# EAGLE design AVR-BASE (EAGLE 7.2.0)

## Sheet 1 of 2
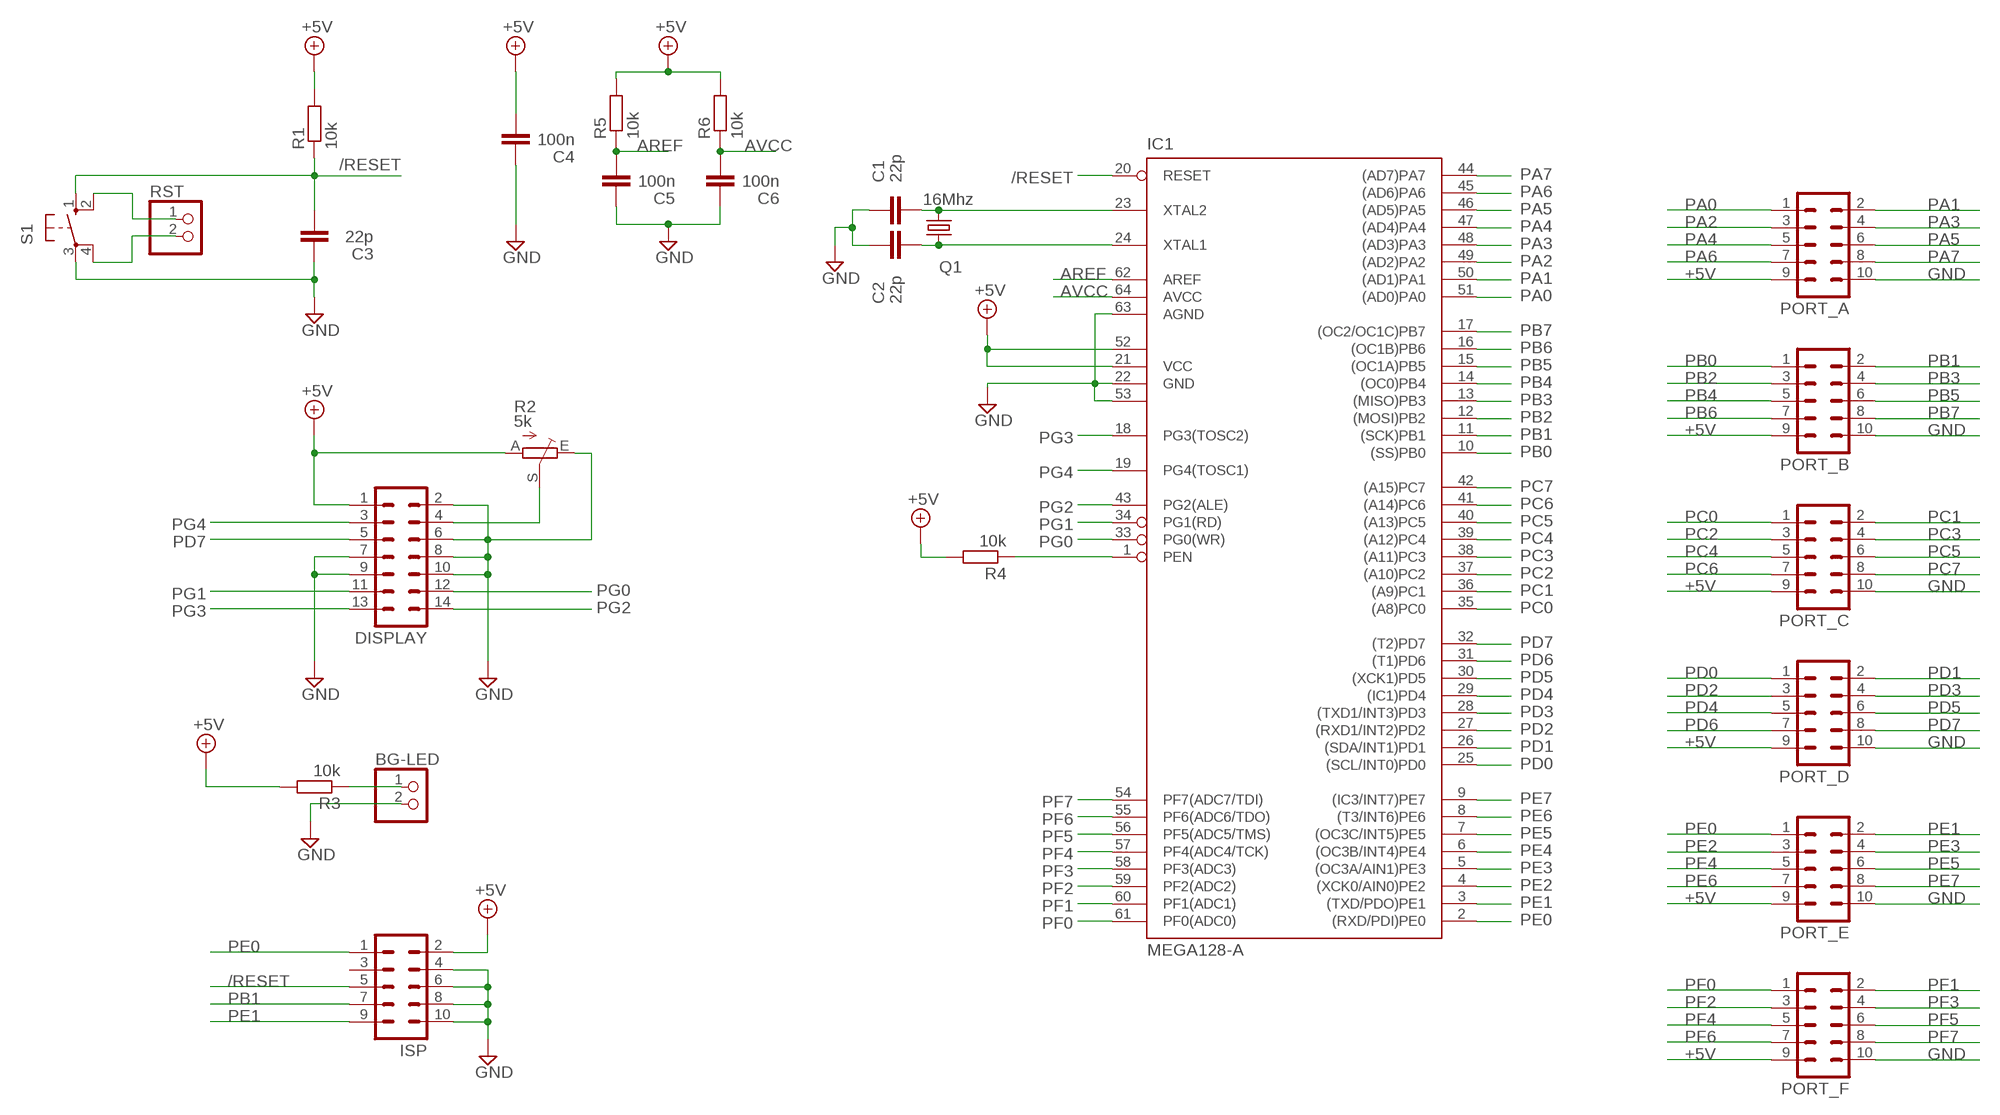
[diagram p0: schematic, sheet 1]

### Parts
BG-LED  PINHD-1X2  [1X02]
C1  22p  C-EU025-025X050  [C025-025X050]
C2  22p  C-EU025-025X050  [C025-025X050]
C3  22p  C-EU025-025X050  [C025-025X050]
C4  100n  C-EU025-025X050  [C025-025X050]
C5  100n  C-EU025-025X050  [C025-025X050]
C6  100n  C-EU025-025X050  [C025-025X050]
DISPLAY  ML14  [ML14]
IC1  MEGA128-A  [TQFP64]
ISP  ML10  [ML10]
PORT_A  ML10  [ML10]
PORT_B  ML10  [ML10]
PORT_C  ML10  [ML10]
PORT_D  ML10  [ML10]
PORT_E  ML10  [ML10]
PORT_F  ML10  [ML10]
Q1  16Mhz  CRYSTALHC49U-V  [HC49U-V]
R1  10k  R-EU_0207/7  [0207/7]
R2  5k  TRIM_EU-B25P  [B25P]
R3  10k  R-EU_0207/7  [0207/7]
R4  10k  R-EU_0204/5  [0204/5]
R5  10k  R-EU_0204/5  [0204/5]
R6  10k  R-EU_0204/5  [0204/5]
RST  PINHD-1X2  [1X02]
S1  10-XX  [B3F-10XX]

### Nets
+5V: C4.2 DISPLAY.1 IC1.21(VCC) IC1.52(VCC1) ISP.2 PORT_A.9 PORT_B.9 PORT_C.9 PORT_D.9 PORT_E.9 PORT_F.9 R1.2 R2.A R3.2 R4.2 R5.2 R6.2 ; also sheet 2
/RESET: C3.2 IC1.20(RESET) ISP.5 R1.1 S1.1(S)
AREF: C5.2 IC1.62(AREF) R5.1
AVCC: C6.2 IC1.64(AVCC) R6.1
GND: BG-LED.2 C1.1 C2.1 C3.1 C4.1 C5.1 C6.1 DISPLAY.2 DISPLAY.6 DISPLAY.7 DISPLAY.8 DISPLAY.9 DISPLAY.10 IC1.22(GND) IC1.53(GND1) IC1.63(AGND) ISP.4 ISP.6 ISP.8 ISP.10 PORT_A.10 PORT_B.10 PORT_C.10 PORT_D.10 PORT_E.10 PORT_F.10 R2.E S1.3(P) ; also sheet 2
N$1: C1.2 IC1.23(XTAL2) Q1.2
N$2: C2.2 IC1.24(XTAL1) Q1.1
N$3: RST.1 S1.2(S1)
N$4: DISPLAY.4 R2.S
N$5: RST.2 S1.4(P1)
N$6: IC1.1(PEN) R4.1
N$8: BG-LED.1 R3.1
PA0: IC1.51((AD0)PA0) PORT_A.1
PA1: IC1.50((AD1)PA1) PORT_A.2
PA2: IC1.49((AD2)PA2) PORT_A.3
PA3: IC1.48((AD3)PA3) PORT_A.4
PA4: IC1.47((AD4)PA4) PORT_A.5
PA5: IC1.46((AD5)PA5) PORT_A.6
PA6: IC1.45((AD6)PA6) PORT_A.7
PA7: IC1.44((AD7)PA7) PORT_A.8
PB0: IC1.10((SS)PB0) PORT_B.1
PB1: IC1.11((SCK)PB1) ISP.7 PORT_B.2
PB2: IC1.12((MOSI)PB2) PORT_B.3
PB3: IC1.13((MISO)PB3) PORT_B.4
PB4: IC1.14((OC0)PB4) PORT_B.5
PB5: IC1.15((OC1A)PB5) PORT_B.6
PB6: IC1.16((OC1B)PB6) PORT_B.7
PB7: IC1.17((OC2/OC1C)PB7) PORT_B.8
PC0: IC1.35((A8)PC0) PORT_C.1
PC1: IC1.36((A9)PC1) PORT_C.2
PC2: IC1.37((A10)PC2) PORT_C.3
PC3: IC1.38((A11)PC3) PORT_C.4
PC4: IC1.39((A12)PC4) PORT_C.5
PC5: IC1.40((A13)PC5) PORT_C.6
PC6: IC1.41((A14)PC6) PORT_C.7
PC7: IC1.42((A15)PC7) PORT_C.8
PD0: IC1.25((SCL/INT0)PD0) PORT_D.1
PD1: IC1.26((SDA/INT1)PD1) PORT_D.2
PD2: IC1.27((RXD1/INT2)PD2) PORT_D.3 ; also sheet 2
PD3: IC1.28((TXD1/INT3)PD3) PORT_D.4 ; also sheet 2
PD4: IC1.29((IC1)PD4) PORT_D.5
PD5: IC1.30((XCK1)PD5) PORT_D.6
PD6: IC1.31((T1)PD6) PORT_D.7
PD7: DISPLAY.5 IC1.32((T2)PD7) PORT_D.8
PE0: IC1.2((RXD/PDI)PE0) ISP.1 PORT_E.1 ; also sheet 2
PE1: IC1.3((TXD/PDO)PE1) ISP.9 PORT_E.2 ; also sheet 2
PE2: IC1.4((XCK0/AIN0)PE2) PORT_E.3
PE3: IC1.5((OC3A/AIN1)PE3) PORT_E.4
PE4: IC1.6((OC3B/INT4)PE4) PORT_E.5
PE5: IC1.7((OC3C/INT5)PE5) PORT_E.6
PE6: IC1.8((T3/INT6)PE6) PORT_E.7
PE7: IC1.9((IC3/INT7)PE7) PORT_E.8
PF0: IC1.61(PF0(ADC0)) PORT_F.1
PF1: IC1.60(PF1(ADC1)) PORT_F.2
PF2: IC1.59(PF2(ADC2)) PORT_F.3
PF3: IC1.58(PF3(ADC3)) PORT_F.4
PF4: IC1.57(PF4(ADC4/TCK)) PORT_F.5
PF5: IC1.56(PF5(ADC5/TMS)) PORT_F.6
PF6: IC1.55(PF6(ADC6/TDO)) PORT_F.7
PF7: IC1.54(PF7(ADC7/TDI)) PORT_F.8
PG0: DISPLAY.12 IC1.33(PG0(WR))
PG1: DISPLAY.11 IC1.34(PG1(RD))
PG2: DISPLAY.14 IC1.43(PG2(ALE))
PG3: DISPLAY.13 IC1.18(PG3(TOSC2))
PG4: DISPLAY.3 IC1.19(PG4(TOSC1))
Unconnected: ISP.3

## Sheet 2 of 2
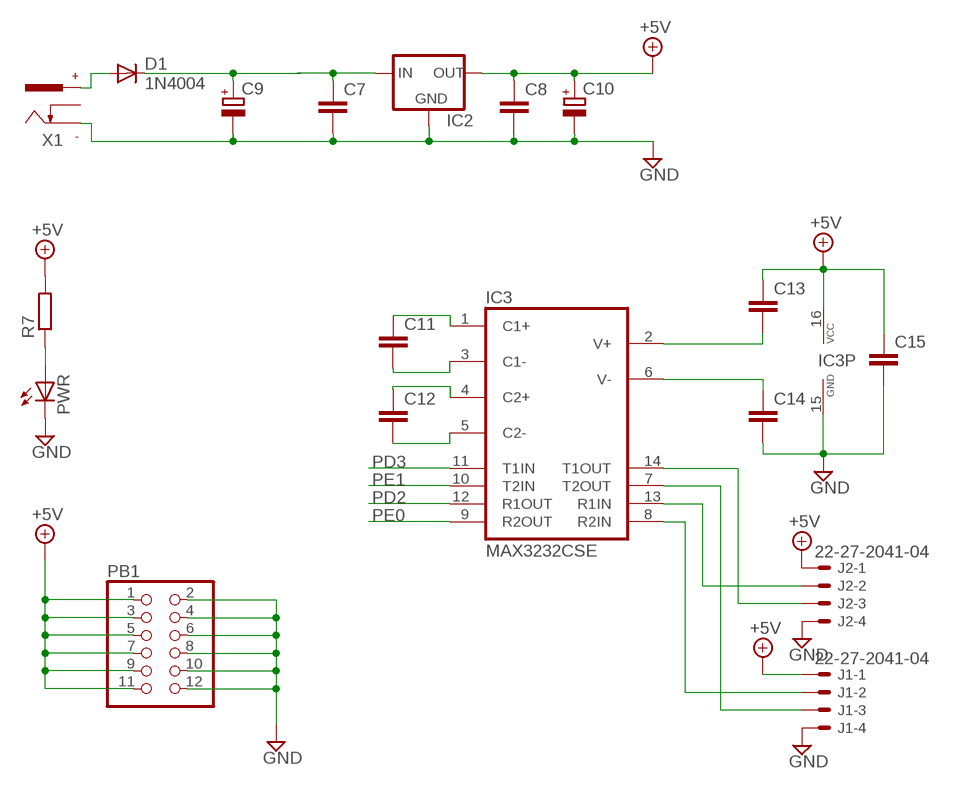
[diagram p1: schematic, sheet 2]

### Parts
C7  C-EU025-025X050  [C025-025X050]
C8  C-EU025-025X050  [C025-025X050]
C9  CPOL-EUE3.5-8  [E3,5-8]
C10  CPOL-EUE3.5-8  [E3,5-8]
C11  C-EU025-025X050  [C025-025X050]
C12  C-EU025-025X050  [C025-025X050]
C13  C-EU025-025X050  [C025-025X050]
C14  C-EU025-025X050  [C025-025X050]
C15  C-EU025-025X050  [C025-025X050]
D1  1N4004  [DO41-10]
IC2  78XXL  [78XXL]
IC3  MAX3232CSE  [SO16]
J1  22-27-2041-04  [6410-04]
J2  22-27-2041-04  [6410-04]
PB1  PINHD-2X6  [2X06]
PWR  LED3MM  [LED3MM]
R7  R-EU_0204/5  [0204/5]
X1  737992-55  [737992-5]

### Nets
+5V: C8.1 C10.+ C13.1 C15.1 IC2.OUT IC3.16(VCC) J1.1 J2.1 PB1.1 PB1.3 PB1.5 PB1.7 PB1.9 PB1.11 R7.2 ; also sheet 1
GND: C7.2 C8.2 C9.- C10.- C14.2 C15.2 IC2.GND IC3.15(GND) J1.4 J2.4 PB1.2 PB1.4 PB1.6 PB1.8 PB1.10 PB1.12 PWR.K(C) X1.+ ; also sheet 1
N$9: C7.1 C9.+ D1.C IC2.IN
N$11: D1.A X1.-1
N$12: PWR.A R7.1
N$13: C11.1 IC3.1(C1+)
N$16: C11.2 IC3.3(C1-)
N$17: C12.1 IC3.4(C2+)
N$18: C12.2 IC3.5(C2-)
N$19: C13.2 IC3.2(V+)
N$20: C14.1 IC3.6(V-)
PD2: IC3.12(R1OUT) ; also sheet 1
PD3: IC3.11(T1IN) ; also sheet 1
PE0: IC3.9(R2OUT) ; also sheet 1
PE1: IC3.10(T2IN) ; also sheet 1
RX0: IC3.8(R2IN) J1.2
RX1: IC3.13(R1IN) J2.2
TX0: IC3.7(T2OUT) J1.3
TX1: IC3.14(T1OUT) J2.3
Unconnected: X1.-2 X1.K

## Library data of the parts
BG-LED RST = pinhead:PINHD-1X2: PIN HEADER
C1-C8 C11-C15 = rcl:C-EU: CAPACITOR, European symbol
C9 C10 = rcl:CPOL-EU: POLARIZED CAPACITOR, European symbol
D1 = diode:1N4004: DIODE general purpose rectifier, 1 A
DISPLAY = con-harting-ml:ML14: HARTING
IC1 = atmel:MEGA128: MICROCONTROLLER 128 Kbytes FLASH 4 Kbytes SRAM 4 Kbytes EEPROM DUAL USART 8-channel 10 bit ADC Source: avr.lbr
IC2 = v-reg:78XXL: VOLTAGE REGULATOR
IC3 = maxim:MAX3232*: True RS-232 Transceivers 3.0V to 5.5V, Low-Power up to 1Mbps, Using Four 0.1µF External Capacitors Source: http://pdfserv.maxim-ic.com/en/ds/MAX3222-MAX3241.pdf
ISP PORT_A PORT_B PORT_C PORT_D PORT_E PORT_F = con-harting-ml:ML10: HARTING
J1 J2 = con-molex:22-?-04: CONNECTOR wire to board 2.54 mm (.1 inch) pitch header; OC_FARNELL: unknown; OC_NEWARK: unknown
PB1 = pinhead:PINHD-2X6: PIN HEADER
PWR = led:LED: LED OSRAM: - CHIPLED LG R971, LG N971, LY N971, LG Q971, LY Q971, LO R971, LY R971 LH N974, LH R974 LS Q976, LO Q976, LY Q976 LO Q996 - Hyper CHIPLED LW Q18S LB Q993, LB Q99A, LB R99A - SideLED LS A670, LO A670, LY A670, LG A670, LP A670 LB A673, LV A673, LT A673, LW A673 LH A674 LY A675 LS A676, LA A676, LO A676, LY A676, LW A676 LS A679, LY A679, LG A679 - Hyper Micro SIDELED® LS Y876, LA Y876, LO Y876, LY Y876 LT Y87S - SmartLED LW L88C, LW L88S LB L89C, LB L89S, LG L890 LS L89K, LO L89K, LY L89K LS L896, LA L896, LO L896, LY L896 - TOPLED LS T670, LO T670, LY T670, LG T670, LP T670 LSG T670, LSP T670, LSY T670, LOP T670, LYG T670 LG T671, LOG T671, LSG T671 LB T673, LV T673, LT T673, LW T673 LH T674 LS T676, LA T676, LO T676, LY T676, LB T676, LH T676, LSB T676, LW T676 LB T67C, LV T67C, LT T67C, LS T67K, LO T67K, LY T67K, LW E67C LS E67B, LA E67B, LO E67B, LY E67B, LB E67C, LV E67C, LT E67C LW T67C LS T679, LY T679, LG T679 LS T770, LO T770, LY T770, LG T770, LP T770 LB T773, LV T773, LT T773, LW T773 LH T774 LS E675, LA E675, LY E675, LS T675 LS T776, LA T776, LO T776, LY T776, LB T776 LHGB T686 LT T68C, LB T68C - Hyper Mini TOPLED® LB M676 - Mini TOPLED Santana® LG M470 LS M47K, LO M47K, LY M47K Source: http://www.osram.convergy.de - LUMILED® LXK2-PW12-R00, LXK2-PW12-S00, LXK2-PW14-U00, LXK2-PW14-V00 LXK2-PM12-R00, LXK2-PM12-S00, LXK2-PM14-U00 LXK2-PE12-Q00, LXK2-PE12-R00, LXK2-PE12-S00, LXK2-PE14-T00, LXK2-PE14-U00 LXK2-PB12-K00, LXK2-PB12-L00, LXK2-PB12-M00, LXK2-PB14-N00, LXK2-PB14-P00, LXK2-PB14-Q00 LXK2-PR12-L00, LXK2-PR12-M00, LXK2-PR14-Q00, LXK2-PR14-R00 LXK2-PD12-Q00, LXK2-PD12-R00, LXK2-PD12-S00 LXK2-PH12-R00, LXK2-PH12-S00 LXK2-PL12-P00, LXK2-PL12-Q00, LXK2-PL12-R00 Source: www.luxeon.com
Q1 = crystal:CRYSTAL: CRYSTAL
R1 R3-R7 = rcl:R-EU_: RESISTOR, European symbol
R2 = pot:TRIM_EU-: POTENTIOMETER
S1 = switch-omron:10-XX: OMRON SWITCH
X1 = con-conrad:737992-55: FEMALE PRINT CONNECTOR DIN 45323 (34V/3A), ROKA, distributor Conrad

## Board
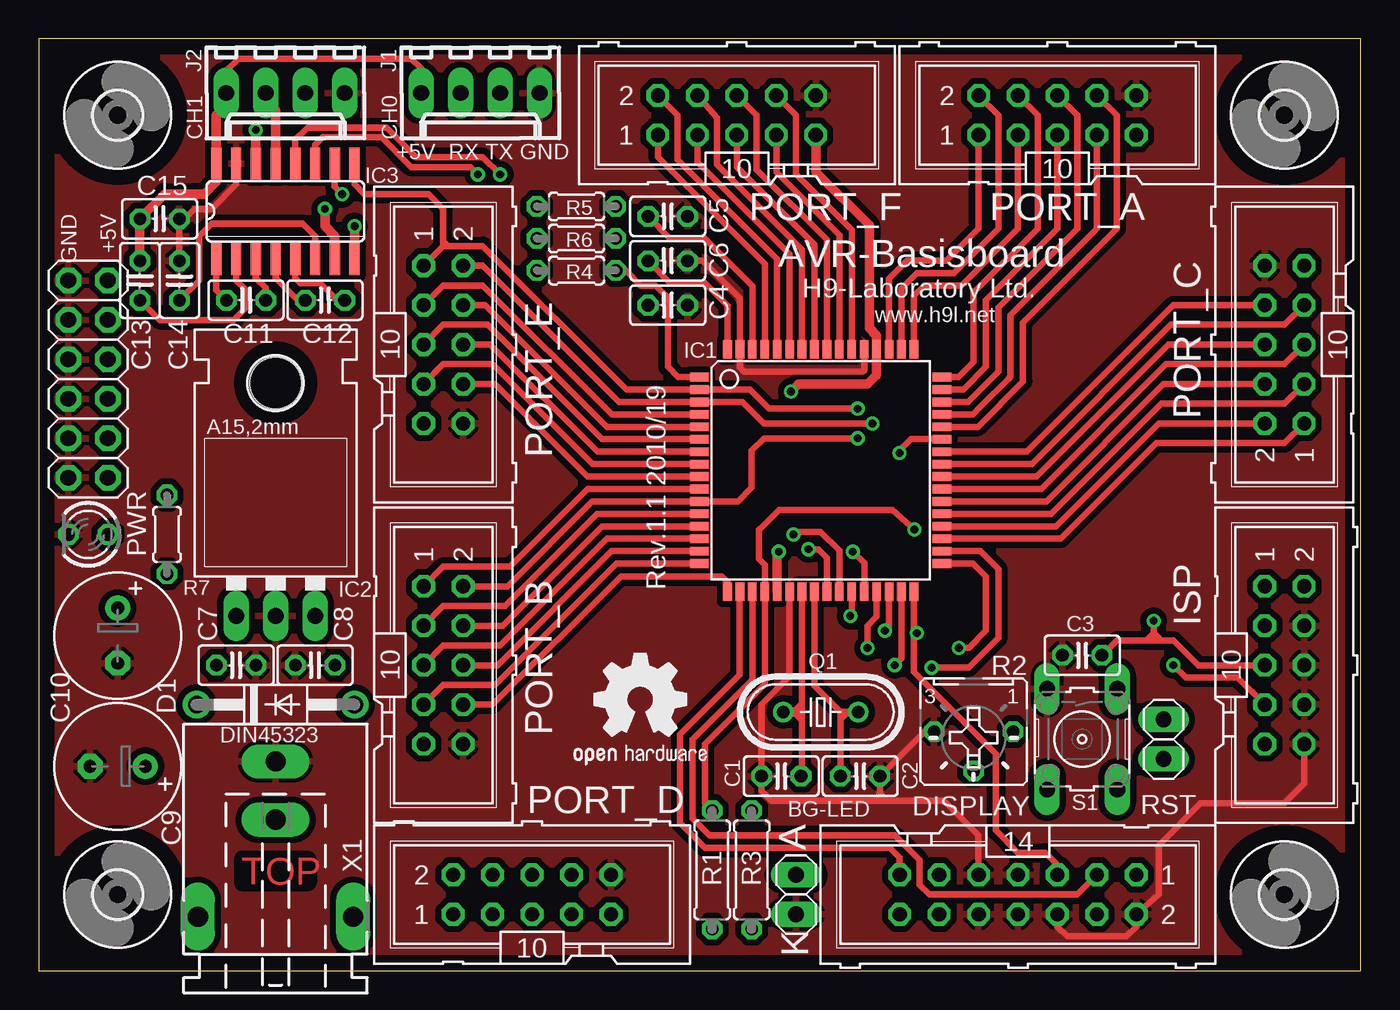
[diagram p2: board, top side]
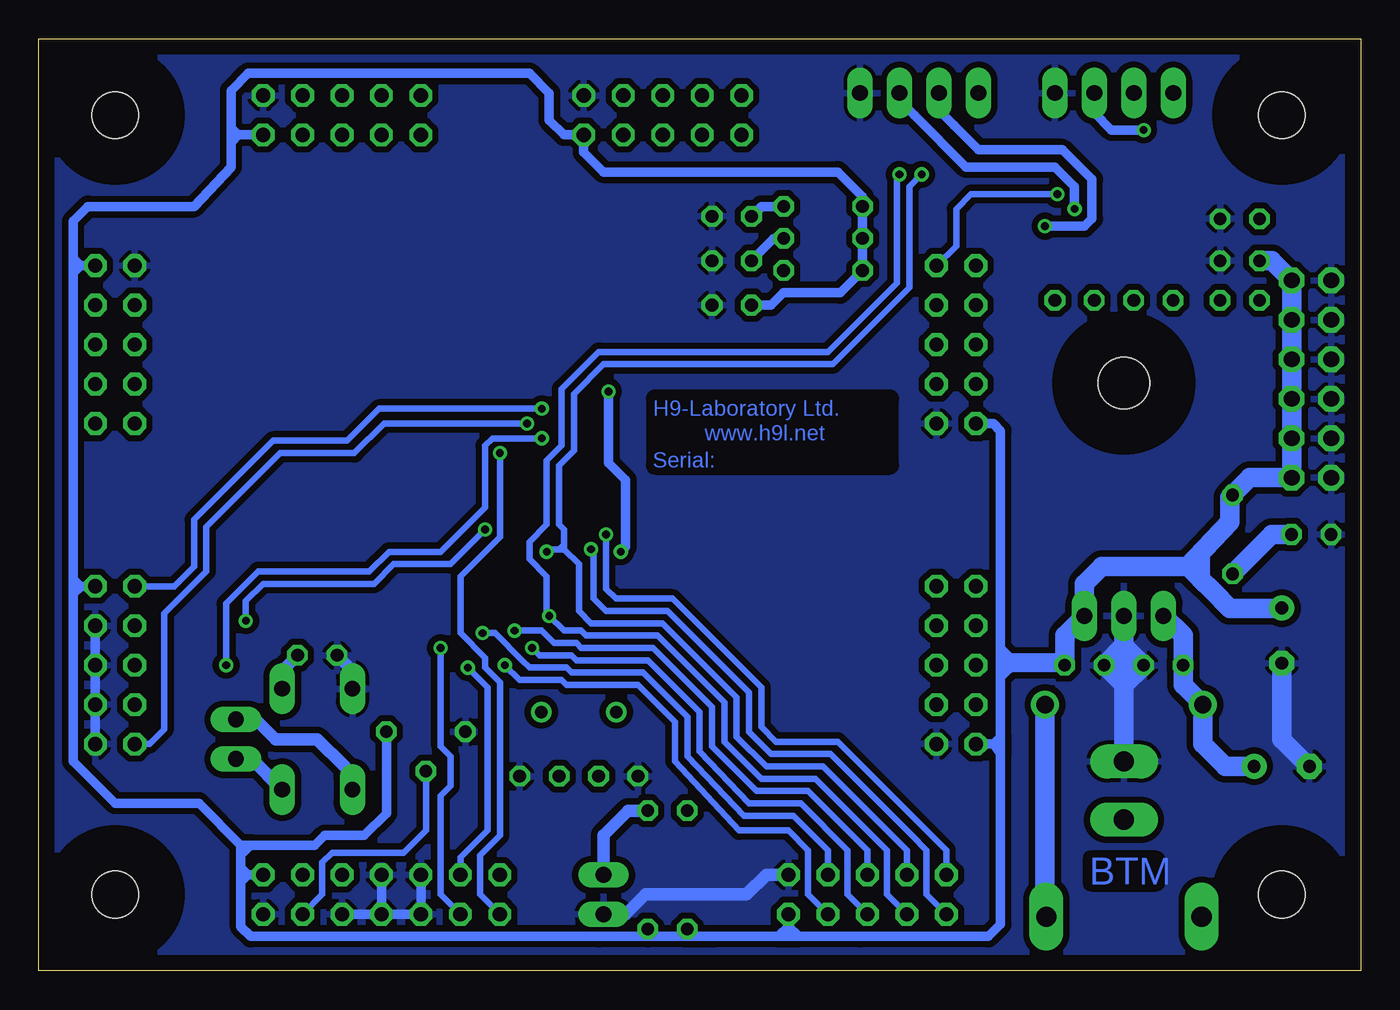
[diagram p3: board, bottom side, seen from below]

Size 85.07 x 60 mm. Coordinates in mm from the lower left corner, seen from the top.
Outline: 0,0 85.07,0 85.07,59.99 0,59.99 0,0
Copper layers (1*16): Top 0.035mm / dielectric 1.5mm / Bottom 0.035mm
Design rules "default *": minimum track width 10mil, minimum drill 15mil, track to track 8mil, track to pad 8mil, pad to pad 8mil, via to via 8mil, smd to smd 8mil, copper to edge 40mil, drill to drill 8mil, minimum pad ring 10mil, minimum via ring 8mil, stop-mask expansion 4mil, vias tented up to drill 0mil, thermal gap 10mil
tRestrict: area 13.2,5.7 to 17.3,7.1
bRestrict: area 13.2,5.7 to 17.3,7.1; area 30.3,32.5 to 45.4,36.8

### Footprints (pad centres in the part's own frame; a part is rotated, then mirrored left to right if it is on the bottom)
1X02 = drill 1.016 long: 1 -1.27,0; 2 1.27,0
C025-025X050 = drill 0.813 octagon: 1 -1.27,0; 2 1.27,0
E3,5-8 = drill 0.813 pad 1.6: + -1.778,0 | drill 0.813 pad 1.6 octagon: - 1.778,0
DO41-10 = drill 1.118: A 5.08,0; C -5.08,0
ML14 = drill 0.914 octagon: 1 -7.62,-1.27; 2 -7.62,1.27; 3 -5.08,-1.27; 4 -5.08,1.27; 5 -2.54,-1.27; 6 -2.54,1.27; 7 0,-1.27; 8 0,1.27; 9 2.54,-1.27; 10 2.54,1.27; 11 5.08,-1.27; 12 5.08,1.27; 13 7.62,-1.27; 14 7.62,1.27
TQFP64 = smd 1.194 x 0.559: 1 -7.8,6; 2 -7.8,5.2; 3 -7.8,4.4; 4 -7.8,3.6; 5 -7.8,2.8; 6 -7.8,2; 7 -7.8,1.2; 8 -7.8,0.4; 9 -7.8,-0.4; 10 -7.8,-1.2; 11 -7.8,-2; 12 -7.8,-2.8; 13 -7.8,-3.6; 14 -7.8,-4.4; 15 -7.8,-5.2; 16 -7.8,-6; 33 7.8,-6; 34 7.8,-5.2; 35 7.8,-4.4; 36 7.8,-3.6; 37 7.8,-2.8; 38 7.8,-2; 39 7.8,-1.2; 40 7.8,-0.4; 41 7.8,0.4; 42 7.8,1.2; 43 7.8,2; 44 7.8,2.8; 45 7.8,3.6; 46 7.8,4.4; 47 7.8,5.2; 48 7.8,6 | smd 0.559 x 1.194: 17 -6,-7.8; 18 -5.2,-7.8; 19 -4.4,-7.8; 20 -3.6,-7.8; 21 -2.8,-7.8; 22 -2,-7.8; 23 -1.2,-7.8; 24 -0.4,-7.8; 25 0.4,-7.8; 26 1.2,-7.8; 27 2,-7.8; 28 2.8,-7.8; 29 3.6,-7.8; 30 4.4,-7.8; 31 5.2,-7.8; 32 6,-7.8; 49 6,7.8; 50 5.2,7.8; 51 4.4,7.8; 52 3.6,7.8; 53 2.8,7.8; 54 2,7.8; 55 1.2,7.8; 56 0.4,7.8; 57 -0.4,7.8; 58 -1.2,7.8; 59 -2,7.8; 60 -2.8,7.8; 61 -3.6,7.8; 62 -4.4,7.8; 63 -5.2,7.8; 64 -6,7.8
78XXL = drill 1.016 long: GND 0,-3.81; IN -2.54,-3.81; OUT 2.54,-3.81 | hole 3.302: 0,11.176
SO16 = smd 0.66 x 2.032: 1 -4.445,-3.073; 2 -3.175,-3.073; 3 -1.905,-3.073; 4 -0.635,-3.073; 5 0.635,-3.073; 6 1.905,-3.073; 7 3.175,-3.073; 8 4.445,-3.073; 9 4.445,3.073; 10 3.175,3.073; 11 1.905,3.073; 12 0.635,3.073; 13 -0.635,3.073; 14 -1.905,3.073; 15 -3.175,3.073; 16 -4.445,3.073
ML10 = drill 0.914 octagon: 1 -5.08,-1.27; 2 -5.08,1.27; 3 -2.54,-1.27; 4 -2.54,1.27; 5 0,-1.27; 6 0,1.27; 7 2.54,-1.27; 8 2.54,1.27; 9 5.08,-1.27; 10 5.08,1.27
6410-04 = drill 1.016 long: 1 3.81,0; 2 1.27,0; 3 -1.27,0; 4 -3.81,0
2X06 = drill 1.016 octagon: 1 -6.35,-1.27; 2 -6.35,1.27; 3 -3.81,-1.27; 4 -3.81,1.27; 5 -1.27,-1.27; 6 -1.27,1.27; 7 1.27,-1.27; 8 1.27,1.27; 9 3.81,-1.27; 10 3.81,1.27; 11 6.35,-1.27; 12 6.35,1.27
LED3MM = drill 0.813 octagon: A -1.27,0; K 1.27,0
HC49U-V = drill 0.813: 1 -2.413,0; 2 2.413,0
0207/7 = drill 0.813 octagon: 1 -3.81,0; 2 3.81,0
B25P = drill 0.813 octagon: A -2.54,0; E 2.54,0; S 0,2.54
0204/5 = drill 0.813 octagon: 1 -2.54,0; 2 2.54,0
B3F-10XX = drill 1.016 long: 1 -3.251,2.261; 2 3.251,2.261; 3 -3.251,-2.261; 4 3.251,-2.261
3,0 = hole 3: 0,0
737992-5 = drill 1.3 pad 2.184 long: + 0,10; -1 5,0; -2 -5,0; K 0,6.25

### Placement (x,y rotation side)
BG-LED  48.73,4.92 270 top
C1  47.78,12.54 0 top
C2  52.86,12.54 180 top
C3  67.15,20.31 0 top
C4  40.48,42.86 180 top
C5  40.48,48.57 180 top
C6  40.48,45.71 180 top
C7  12.7,19.68 0 top
C8  17.78,19.68 180 top
C9  5.08,13.17 180 top
C10  5.08,21.58 270 top
C11  13.33,43.17 0 top
C12  18.41,43.17 0 top
C13  6.5,44.44 270 top
C14  9.04,44.44 90 top
C15  7.77,48.41 0 top
D1  15.23,17.14 0 top
DISPLAY  63.02,4.92 180 top
IC1  50.32,32.22 0 top
IC2  15.23,26.66 0 top
IC3  15.87,48.89 0 top
ISP  80.16,19.68 270 top
J1  28.41,56.51 180 top
J2  15.87,56.51 180 top
PB1  3.17,38.09 90 top
PORT_A  65.56,55.08 0 top
PORT_B  26.03,19.68 270 top
PORT_C  80.16,40.32 90 top
PORT_D  31.75,4.92 0 top
PORT_E  26.03,40.32 270 top
PORT_F  44.92,55.08 0 top
PWR  3.17,28.09 180 top
Q1  50.32,16.66 180 top
R1  43.33,6.5 270 top
R2  60.16,15.39 180 top
R3  45.87,6.5 270 top
R4  34.6,45.08 180 top
R5  34.6,49.21 180 top
R6  34.6,47.14 180 top
R7  8.25,28.09 90 top
RST  72.38,14.92 90 top
S1  67.15,14.92 270 top
U$1  [3,0]  80.16,55.08 0 top
U$2  [3,0]  5.08,4.91 0 top
U$3  [3,0]  80.16,4.92 0 top
U$4  [3,0]  5.08,55.08 0 top
X1  15.24,3.49 0 top

### Tracks (layer width: path | path; a pad name or v marks a point on that pad's centre or on a via)
+5V  (via drill 0.5)  (1 unrouted)
  Top 0.406: v47.62,26.98 47.52,26.88 | C15.1 | C15.1 | J2.1 | R5.2 | R5.2 | J2.1 12.06,57.94 12.85,58.73 23.97,58.73 24.6,58.1 J1.1 | C13.1 | IC3.16
  Top 0.61: v48.41,37.3 48.89,37.78 53.33,37.78 53.92,38.36 IC1.52 53.92,40.9 53.44,41.38 53.44,47.99 50,51.43 PORT_F.9 | 47.52,26.88 IC1.21 | PORT_F.9 | C13.1 C15.1 8.09,50 10,50 10.63,50 11.42,50.79 IC3.16 11.42,55.08 12.06,55.71 J2.1
  Bottom 0.406: 45.87,2.22 | 45.87,2.22 R3.2 | PORT_F.9 | C8.1
  Bottom 0.61: R2.A 62.7,10.15 64.13,8.73 66.67,8.73 67.3,8.09 71.43,8.09 | 72.07,6.18 72.07,6.66 | 72.07,6.66 72.07,7.46 | 72.07,7.46 72.07,8.09 | 72.07,5.71 72.07,2.85 71.43,2.22 49.05,2.22 45.87,2.22 43.33,2.22 | 72.07,5.71 72.07,6.18 | 72.07,6.18 71.59,6.18 | 71.59,6.18 | 71.59,6.18 DISPLAY.1 | 42.86,2.22 41.59,2.22 | 43.33,2.22 43.49,2.22 43.33,2.38 R1.2 43.33,2.22 | 82.86,24.76 81.59,24.76 | 82.86,24.28 82.86,13.49 80.16,10.79 74.77,10.79 72.07,8.09 | 82.86,24.28 82.86,24.76 | 72.07,8.09 71.43,8.09 | 72.07,6.66 71.59,6.18 | 72.07,5.71 71.59,6.18 | 72.07,7.46 71.43,8.09 | 81.59,24.76 ISP.2 | 82.39,24.76 81.59,24.76 | 82.39,24.76 82.86,24.76 | 82.86,24.76 82.86,45.4 | 82.86,45.4 | 82.86,45.4 | PORT_C.9 | 82.54,45.4 82.39,45.4 | PORT_C.9 82.39,45.4 | 82.86,45.4 PORT_C.9 | 82.86,45.4 | 82.86,45.4 | 82.54,45.4 82.86,45.4 | 82.86,45.4 | 82.86,45.4 82.54,45.4 | 82.86,45.4 82.86,48.25 81.91,49.21 75.08,49.21 | 75.08,49.21 | 75.08,49.21 72.7,51.75 72.7,53.33 | 72.7,53.33 72.7,53.81 | 72.7,53.81 | 72.7,53.81 PORT_A.9 | PORT_A.9 | PORT_A.9 | 37.46,2.22 42.86,2.22 | 42.86,2.22 43.17,2.22 43.33,2.22 | PORT_D.9 | 36.82,2.85 PORT_D.9 | 36.82,2.22 37.46,2.22 | 36.82,2.22 36.82,2.85 | 36.82,2.85 PORT_D.9 | 32.22,2.22 36.19,2.22 | 36.19,2.22 36.82,2.22 | 32.22,2.22 | 32.22,2.22 23.97,2.22 23.17,3.01 23.17,13.96 | 23.17,13.96 23.17,14.44 23.33,14.6 | 23.65,14.6 23.33,14.6 | 36.19,2.22 36.82,2.85 | 36.82,2.85 | 36.82,2.85 37.46,2.22 | 23.65,14.6 PORT_B.9 | 23.33,14.6 23.17,14.6 23.17,15.08 | 23.17,15.08 23.17,18.88 | 23.17,18.88 23.17,19.52 | 23.17,19.52 23.17,19.68 | 23.17,19.68 23.17,20.15 | 23.17,20.79 23.17,20.15 | 23.17,20.79 23.17,34.76 | PORT_E.9 | 23.65,35.24 24.6,35.24 PORT_E.9 | 23.65,14.6 23.17,15.08
  Bottom 0.61: 23.65,14.6 | 23.17,13.96 23.65,14.6 | 23.17,34.76 | 23.17,34.76 23.65,35.24 | 23.17,34.76 23.65,35.24 | 72.7,53.81 72.23,53.81 | 72.23,53.81 PORT_A.9 | 72.7,53.81 72.7,54.29 | 72.7,54.29 72.7,56.67 71.59,57.78 53.49,57.78 52.22,56.51 52.22,54.76 51.27,53.81 PORT_F.9 | PORT_F.9 49.84,53.81 PORT_F.9 | v48.41,37.3 48.41,32.7 47.3,31.58 47.3,27.3 v47.62,26.98 | 72.23,53.81 72.7,54.29 | 72.23,53.81 | 72.7,53.33 72.23,53.81 | 82.39,45.4 82.86,44.92 | 82.39,45.4 | 82.39,45.4 82.86,45.87 | 82.39,24.76 | 82.39,24.76 82.86,25.23 | 82.86,24.28 82.39,24.76 | PORT_F.9 50,52.7 48.73,51.43 33.65,51.43 32.06,49.84 R4.2 | C4.2 37.94,42.86 37.14,43.65 33.49,43.65 R4.2 | 32.06,46.98 | 32.06,46.98 R6.2 R4.2 | 32.06,46.98 R5.2 | 32.06,46.98 | R4.2 | R4.2 | 23.17,19.68 C8.1 | 23.17,20.15 19.36,20.15 | 23.17,19.52 19.2,19.52 | 23.17,20.79 22.22,19.84 23.17,18.88
  Bottom 1.27: IC2.OUT 19.04,21.58 C8.1 | 5.04,23.33 C10.+ 5.07,23.33 | 11.11,26.03 16.66,26.03 17.77,24.92 IC2.OUT | IC2.OUT | 10.31,25.23 9.52,24.44 8.41,23.33 5.07,23.33 | 11.11,26.03 10.31,25.23 | 5.07,23.33 | 11.11,26.03 8.41,28.89 8.41,30.47 | 8.41,30.47 | 8.41,30.47 R7.2 7.14,31.74 PB1.1 | 10.31,25.23 10.31,26.82 | PB1.1 | PB1.1 PB1.3 | PB1.3 | PB1.3 PB1.5 | PB1.5 | PB1.5 PB1.7 | PB1.7 | PB1.7 PB1.9 | PB1.9 | PB1.9 PB1.11 | PB1.11 | PB1.11 5.71,45.71 C13.1
/RESET  (via drill 0.5)
  Top 0.406: R1.1 42.86,10.79 42.86,14.6 45.24,16.98 46.72,18.46 IC1.20 46.72,26.14 46.35,26.5 46.35,28.41 46.4,28.46 47.62,29.68 54.92,29.68 v56.35,28.41 | ISP.5 74.61,19.68 73.02,21.27 72.23,21.27 | v71.75,22.54 | 71.75,21.27 72.23,21.27 | v71.75,22.54 71.75,21.74 | 71.75,21.74 71.75,21.27 | 71.75,21.27 71.27,21.27 | 71.27,21.27 69.37,21.27 C3.2 | 71.75,21.74 71.27,21.27 | 71.75,21.74 72.23,21.27
  Bottom 0.406: v56.35,28.41 57.14,27.62 58.57,26.19 62.22,26.19 63.49,24.92 70.64,24.92 71.75,23.81 v71.75,22.54 | C3.2
  Bottom 0.813: S1.1 69.41,19.32 C3.2
AREF
  Top 0.406: C5.2 | C5.2 | 42.86,47.14 | 42.86,47.14 40.63,47.14 C5.2 | IC1.62 45.92,44.08 42.86,47.14
  Bottom 0.61: C5.2 | R5.1 38.57,49.21 C5.2
AVCC
  Top 0.406: IC1.64 44.32,42.82 42.86,44.28 40.63,44.28 C6.2
  Bottom 0.61: R6.1 37.78,47.14 C6.2
GND
  Top 0.406: DISPLAY.6 65.56,2.85 66.19,2.22 70,2.22 70.64,2.85 DISPLAY.2 72.07,4.92 72.07,8.09 74.77,10.79 80.16,10.79 81.43,12.06 ISP.10 | IC1.22 48.32,18.95 46.51,17.14 46.51,12.22 | C1.1 46.51,12.22 | 46.51,12.22 46.51,11.58 47.14,10.95 53.81,10.95 | 53.81,10.95 54.13,10.95 | 54.13,10.95 54.13,11.42 | 54.13,11.42 C2.1 56.99,15.39 R2.E | 54.13,10.95 54.6,10.95 | 54.6,10.95 58.26,10.95 60.48,8.73 DISPLAY.9 | 53.81,10.95 53.65,10.95 | 53.81,10.95 54.13,11.42 | 54.13,11.42 | 54.13,11.42 54.6,10.95 | IC1.53 53.12,38.67 53.02,38.57 45.4,38.57 | 45.4,38.57 45.12,38.85 | C6.1 42.7,45.71 45.12,43.29 IC1.63 45.12,38.85 | 45.4,38.57 | 45.12,38.85 45.4,38.57 | IC3.15 12.69,50.63 11.11,49.05 10,49.05 | 10,49.05 | 9.2,48.25 9.04,48.09 C14.2 | 9.2,48.25 10,49.05 | 9.2,48.25 C15.2
  Bottom 0.406: C3.1 | C1.1
  Bottom 0.61: DISPLAY.8 DISPLAY.6 | DISPLAY.8 DISPLAY.10 DISPLAY.9 | DISPLAY.8 DISPLAY.7 | ISP.10 ISP.8 ISP.6 ISP.4
  Bottom 0.813: S1.3 64.89,19.32 C3.1 | PORT_D.10 38.25,6.18 39.52,4.92 46.03,4.92 47.3,3.64 BG-LED.2
  Bottom 1.27: IC2.GND | 15.23,19.68 15.23,20.95 | C7.2 | 15.23,19.68 C7.2 | C8.2 | C8.2 | C8.2 | 15.23,19.68 C8.2 | X1.+ 15.23,18.41 | 15.23,18.41 15.23,19.68 | C7.2 15.23,20.95 | 15.23,20.95 IC2.GND | C8.2 15.23,20.95 | 15.23,18.41 C7.2 | 15.23,18.41 C8.2 | C9.- 3.33,13.17 5.07,14.92 C10.-
  pour Top (isolate 0.406): 0.31,59.68 0.31,0.31 84.77,0.31 84.77,59.68 81.43,59.68 81.43,59.68
  pour Bottom (isolate 0.406): 0.31,59.68 0.31,0.31 84.77,0.31 84.77,59.68 81.43,59.68 81.43,59.68
N$1
  Top 0.406: C1.2 | 49.12,16.66 49.12,12.61 C1.2 | 49.12,16.66 IC1.23 | 49.12,16.66 48.89,16.66 | Q1.2 | 48.57,16.66 49.05,16.19 49.05,17.14 48.57,16.66
  Top 0.61: 48.89,16.66 48.57,16.66 Q1.2
N$2
  Top 0.406: IC1.24 49.92,18.33 51.59,16.66 | C2.2 51.59,16.19 | 51.59,16.19 51.59,16.66 | 51.59,16.66 Q1.1 | 51.59,16.66 | 51.59,16.19 52.06,16.66
N$3
  Bottom 0.406: RST.1 | RST.1
  Bottom 0.813: S1.2 71.39,13.65 RST.1
N$4
  Bottom 0.406: DISPLAY.4 66.83,4.92 66.83,6.98 66.19,7.61 61.59,7.61 60.16,9.04 R2.S
N$5
  Bottom 0.406: 64.92,11.74 64.89,11.7 S1.4 | 65.4,13.17
  Bottom 0.813: RST.2 71.11,16.19 69.84,14.92 67.15,14.92 65.4,13.17 64.92,12.69 64.92,11.74
N$6
  Top 0.406: R4.1 37.78,45.08 38.73,44.13 39.68,44.13 40.48,43.33 40.48,38.89 41.14,38.22 IC1.1
N$8
  Bottom 0.406: BG-LED.1
  Bottom 0.813: R3.1 47.14,10.31 48.73,8.73 BG-LED.1
N$9
  Bottom 1.27: IC2.IN 11.42,21.58 C7.1 | C7.1 | D1.C | D1.C 11.42,18.41 C7.1 | C9.+ 8.73,13.17 10.15,14.6 D1.C
N$11
  Bottom 1.27: D1.A 20.31,16.66 20.31,5 X1.-1
N$12
  Bottom 0.61: R7.1
  Bottom 1.27: PWR.A 5.71,28.09 R7.1
N$13
  Top 0.406: C11.1 11.42,43.81 11.42,43.97 IC3.1
N$16
  Top 0.406: C11.2 14.6,43.97 13.96,44.6 IC3.3
N$17
  Top 0.406: IC3.4 15.23,44.6 16.66,43.17 C12.1
N$18
  Top 0.406: C12.2 19.2,43.17 18.09,44.28 16.82,44.28 16.5,44.6 16.5,46.03 | 16.5,46.03 | IC3.5 16.5,46.03
N$19
  Top 0.406: IC3.2 12.69,44.76 12.69,44.44 13.33,43.81 13.33,42.7 12.54,41.9 7.77,41.9 C13.2
N$20
  Top 0.406: IC3.6 17.77,47.3 16.98,48.09 11.11,48.09 10.31,47.3 10.31,44.44 C14.1 | C14.1
PA0
  Top 0.406: PORT_A.1 60.48,47.78 58.41,45.71 55.87,45.71 54.72,44.56 IC1.51
PA1
  Top 0.406: PORT_A.2 61.75,55.08 61.75,47.78 58.89,44.92 56.51,44.92 55.52,43.93 IC1.50
PA2
  Top 0.406: PORT_A.3 63.02,47.78 59.37,44.13 56.99,44.13 56.32,43.46 IC1.49
PA3
  Top 0.406: PORT_A.4 64.29,55.08 64.29,47.78 60.16,43.65 60.16,39.2 59.19,38.23 58.12,38.23 | 58.12,38.23 58.1,38.25 | IC1.48 58.12,38.23
PA4
  Top 0.406: IC1.47 59.49,37.42 60.95,38.89 60.95,43.17 65.56,47.78 PORT_A.5
PA5
  Top 0.406: IC1.46 59.8,36.62 61.75,38.57 61.75,42.7 66.83,47.78 66.83,55.08 PORT_A.6
PA6
  Top 0.406: IC1.45 60.11,35.82 60.64,36.35 62.38,38.09 | 62.38,38.09 | 62.38,38.09 62.54,38.25 62.54,42.22 68.1,47.78 | PORT_A.7 68.1,47.78 | 68.1,47.78
PA7
  Top 0.406: IC1.44 60.42,35.02 63.34,37.94 63.34,41.59 63.34,41.74 | 69.37,47.78 69.37,55.08 PORT_A.8 | 69.37,47.78 | 63.34,41.74 | 63.34,41.74 69.37,47.78
PB0
  Top 0.406: IC1.10 35.31,31.02 30.32,26.03 26.03,26.03 PORT_B.1
PB1  (via drill 0.5)
  Top 0.406: PORT_B.2 30.16,24.76 35.62,30.22 IC1.11 44.98,30.22 45.87,31.11 45.87,33.49 46.67,34.28 v52.7,34.28 | ISP.7 77.15,18.88 73.81,18.88 v73.02,19.68
  Bottom 0.406: v73.02,19.68 73.02,23.65 70.96,25.71 63.81,25.71 62.54,26.98 59.21,26.98 56.35,29.84 56.35,33.81 55.87,34.28 53.81,34.28 v52.7,34.28
PB2
  Top 0.406: IC1.12 35.93,29.42 30,23.49 26.03,23.49 PORT_B.3
PB3
  Top 0.406: PORT_B.4 29.84,22.22 36.24,28.62 IC1.13
PB4
  Top 0.406: IC1.14 36.55,27.82 29.68,20.95 26.03,20.95 PORT_B.5
PB5
  Top 0.406: PORT_B.6 29.52,19.68 36.86,27.02 IC1.15
PB6
  Top 0.406: IC1.16 37.17,26.22 29.36,18.41 26.03,18.41 PORT_B.7
PB7
  Top 0.406: IC1.17 44.32,25.04 43.97,25.39 37.46,25.39 29.2,17.14 PORT_B.8
PC0
  Top 0.406: PORT_C.1 | PORT_C.1 80.16,33.97 71.91,33.97 65.76,27.82 IC1.35
PC1
  Top 0.406: IC1.36 65.45,28.62 72.07,35.24 | 78.73,35.24 | 78.73,35.24 PORT_C.2 | 72.07,35.24 78.73,35.24 | 72.07,35.24
PC2
  Top 0.406: PORT_C.3 | PORT_C.3 80.16,36.51 72.23,36.51 65.14,29.42 IC1.37
PC3
  Top 0.406: PORT_C.4 | PORT_C.4 72.38,37.78 64.83,30.22 IC1.38
PC4
  Top 0.406: PORT_C.5 | PORT_C.5 80.16,39.05 72.54,39.05 64.52,31.02 IC1.39
PC5
  Top 0.406: PORT_C.6 74.77,40.32 72.7,40.32 | 72.7,40.32 | IC1.40 64.21,31.82 72.7,40.32
PC6
  Top 0.406: IC1.41 63.89,32.62 72.86,41.59 80.16,41.59 PORT_C.7 | PORT_C.7
PC7
  Top 0.406: IC1.42 63.58,33.42 73.02,42.86 | PORT_C.8 74.77,42.86 73.02,42.86 | 73.02,42.86 | 73.02,42.86 | 73.02,42.86
PD0  (via drill 0.5)
  Top 0.406: IC1.25 50.72,26.58 50.16,27.14 v49.52,27.14
  Bottom 0.406: PORT_D.1 | PORT_D.1 27.93,4.92 27.93,7.77 28.89,8.73 | 28.89,8.73 | 28.89,8.73 34.13,13.96 37.94,13.96 39.36,15.39 39.36,17.93 40.16,18.73 | 40.16,18.73 | 40.16,18.73 44.44,23.01 | 44.44,23.01 | 44.44,23.01 44.6,23.17 48.57,23.17 49.37,23.96 49.37,26.98 v49.52,27.14 | v49.52,27.14
PD1  (via drill 0.5)
  Top 0.406: IC1.26 51.52,27.05 50.32,28.25 48.73,28.25 v48.57,28.09
  Bottom 0.406: PORT_D.2 26.66,7.77 | 26.66,7.77 | 26.66,7.77 27.62,8.73 | 27.62,8.73 | 27.62,8.73 31.9,13.01 | 31.9,13.01 | 31.9,13.01 33.65,14.76 37.62,14.76 38.57,15.71 38.57,18.25 44.29,23.96 47.94,23.96 48.57,24.6 v48.57,28.09
PD2  (via drill 0.5)
  Top 0.406: IC1.27 52.32,22.95 v52.22,22.85 | IC3.12 16.5,53.49 17.3,54.29 22.38,54.29 24.28,52.38 28.57,52.38 v29.68,51.27
  Bottom 0.406: PORT_D.3 | PORT_D.3 30.47,4.92 30.47,7.77 35.08,12.38 38.57,12.38 40.95,14.76 40.95,17.3 41.43,17.77 | 41.43,17.77 | 41.43,17.77 45.08,21.42 | 45.08,21.42 | 45.08,21.42 45.24,21.58 49.84,21.58 50.16,21.9 51.27,21.9 v52.22,22.85 | v52.22,22.85 | v52.22,22.85 52.38,23.01 52.38,25.39 53.49,26.5 53.49,27.62 52.38,28.73 52.38,32.85 51.43,33.81 51.43,37.46 49.05,39.84 34.28,39.84 29.84,44.28 29.84,51.11 v29.68,51.27
PD3  (via drill 0.5)
  Top 0.406: IC1.28 53.12,26.24 v52.38,26.98 | IC3.11 17.77,53.17 18.25,53.65 22.06,53.65 23.97,51.75 27.78,51.75 v28.25,51.27
  Bottom 0.406: PORT_D.4 29.2,7.77 30.16,8.73 | 30.16,8.73 | 30.16,8.73 34.6,13.17 38.25,13.17 40.16,15.08 40.16,17.61 44.92,22.38 49.52,22.38 50.32,23.17 50.32,26.19 | 50.32,26.19 51.27,27.14 51.59,27.14 | 51.59,27.14 52.22,27.14 v52.38,26.98 | 50.32,26.19 51.27,27.14 51.27,27.46 | 51.27,27.46 51.27,28.41 51.59,28.73 51.59,32.54 50.64,33.49 50.64,37.14 48.73,39.05 33.97,39.05 29.05,43.97 29.05,50.48 v28.25,51.27 | 51.27,27.46 51.59,27.14
PD4  (via drill 0.5)
  Top 0.406: v53.33,20.79 53.33,22.22 53.92,22.8 IC1.29
  Bottom 0.406: PORT_D.5 | PORT_D.5 33.01,4.92 33.01,7.77 36.03,10.79 39.36,10.79 42.54,14.12 42.54,16.66 43.17,17.3 | 43.17,17.3 | 43.17,17.3 45.87,20 50.48,20 50.79,20.31 52.86,20.31 v53.33,20.79 | v53.33,20.79
PD5  (via drill 0.5)
  Top 0.406: IC1.30 54.72,22.17 v54.45,21.9
  Bottom 0.406: PORT_D.6 31.74,7.77 34.6,10.63 | v54.45,21.9 52.7,21.9 51.91,21.11 50.48,21.11 50.16,20.79 45.56,20.79 41.75,16.98 41.75,14.44 38.89,11.58 35.55,11.58 35.4,11.42 34.6,10.63 | 34.6,10.63
PD6  (via drill 0.5)
  Top 0.406: IC1.31 55.52,20.12 v55.08,19.68
  Bottom 0.406: PORT_D.7 | PORT_D.7 35.55,4.92 35.55,7.77 36.82,9.04 40,9.04 44.13,13.49 44.13,16.03 46.51,18.41 51.11,18.41 51.43,18.73 54.13,18.73 v55.08,19.68
PD7  (via drill 0.5)
  Top 0.406: 56.32,21.74 56.32,19.23 61.59,13.96 61.59,12.06 61.59,9.04 | 56.32,21.74 IC1.32 | DISPLAY.5 65.56,6.82 64.76,7.61 63.02,7.61 61.59,9.04 | 61.59,9.04 | 56.32,21.74 v56.51,21.74 56.35,21.74
  Bottom 0.406: PORT_D.8 34.28,7.77 | 34.28,7.77 | 34.28,7.77 36.51,10 | 36.51,10 | 36.51,10 39.68,10 43.33,13.81 43.33,16.34 46.19,19.2 46.35,19.2 50.79,19.2 51.11,19.52 53.49,19.52 53.97,20 | 53.97,20 | 53.97,20 55.72,21.74 v56.51,21.74
PE0  (via drill 0.5)
  Top 0.406: v52.7,36.19 46.98,36.19 45.75,37.42 IC1.2 37.82,37.42 28.57,46.67 26.35,46.67 | PORT_E.1 | PORT_E.1 26.03,46.67 | 26.03,46.67 26.35,46.67 | 26.03,46.67 PORT_E.1 | 26.03,46.67 26.03,46.98 | 26.03,46.98 26.03,49.05 25.08,50 20.95,50 20.31,50.63 20.31,52.06 | 20.31,52.06 | 20.31,52.06 IC3.9 | 26.35,46.67 26.03,46.98
  Bottom 0.406: ISP.1 76.35,24.76 75.08,26.03 75.08,29.04 70,34.12 65.24,34.12 63.18,36.19 v52.7,36.19
PE1  (via drill 0.5)
  Top 0.406: 46.51,35.39 45.28,36.62 IC1.3 37.35,36.62 28.57,45.4 PORT_E.2 | 46.51,35.39 | 46.51,35.39 46.67,35.24 52.7,35.24 v53.65,35.24 | IC3.10 19.04,50.48 v19.52,50
  Bottom 0.406: ISP.9 77.94,14.6 76.99,15.55 76.99,23.01 74.29,25.71 74.29,28.57 69.53,33.33 64.76,33.33 62.86,35.24 v53.65,35.24 | PORT_E.2 | PORT_E.2 26.03,46.67 26.03,49.05 25.08,50 v19.52,50
PE2
  Top 0.406: IC1.4 36.88,35.82 28.57,44.13 26.03,44.13 PORT_E.3 | PORT_E.3
PE3
  Top 0.406: IC1.5 36.56,35.02 28.73,42.86 28.57,42.86 | PORT_E.4 28.57,42.86 | 28.57,42.86
PE4
  Top 0.406: IC1.6 36.25,34.22 28.89,41.59 26.03,41.59 PORT_E.5 | PORT_E.5
PE5
  Top 0.406: IC1.7 35.94,33.42 29.05,40.32 28.57,40.32 | PORT_E.6 28.57,40.32 | 28.57,40.32
PE6
  Top 0.406: IC1.8 35.63,32.62 29.2,39.05 26.03,39.05 PORT_E.7 | PORT_E.7
PE7
  Top 0.406: IC1.9 35.32,31.82 35.08,32.06 | PORT_E.8 28.57,37.78 | 28.57,37.78 | 35.08,32.06 | 28.57,37.78 29.36,37.78 35.08,32.06
PF0
  Top 0.406: IC1.61 46.72,45.5 39.84,52.38 | 39.84,52.38 | PORT_F.1 39.84,52.38
PF1
  Top 0.406: IC1.60 47.52,45.81 41.11,52.22 41.11,55.08 PORT_F.2
PF2
  Top 0.406: IC1.59 48.32,46.13 42.38,52.06 PORT_F.3 | PORT_F.3
PF3
  Top 0.406: PORT_F.4 43.65,54.92 43.65,51.91 49.12,46.44 IC1.58
PF4
  Top 0.406: IC1.57 49.92,46.75 44.92,51.75 PORT_F.5 | PORT_F.5
PF5
  Top 0.406: PORT_F.6 46.19,55.08 46.19,51.59 50.72,47.06 IC1.56
PF6
  Top 0.406: IC1.55 51.52,47.37 47.46,51.43 47.46,53.65 PORT_F.7
PF7
  Top 0.406: IC1.54 52.32,47.68 | PORT_F.8 48.73,55.08 48.73,51.27 52.32,47.68 | 52.32,47.68
PG0  (via drill 0.5 pad 0.3)
  Top 0.406: IC1.33 60.13,26.22 60.95,25.39 60.95,21.9 59.84,20.79 v59.21,20.79
  Bottom 0.406: DISPLAY.12 59.21,4.92 59.21,11.27 58.57,11.9 58.57,13.81 59.21,14.44 v59.21,20.79
PG1  (via drill 0.5 pad 0.3)
  Top 0.406: IC1.34 60.6,27.02 61.75,25.87 61.75,21.42 59.84,19.52 v57.46,19.52
  Bottom 0.406: DISPLAY.11 57.94,7.3 56.19,9.04 56.19,18.25 v57.46,19.52
PG2  (via drill 0.5 pad 0.3)
  Top 0.406: IC1.43 56.13,34.22 55.4,33.49 v55.4,33.33
  Bottom 0.406: DISPLAY.14 56.67,4.92 56.67,7.46 55.4,8.73 55.4,18.57 56.35,19.52 56.35,20.15 57.94,21.74 | 57.94,21.74 57.94,25.39 55.4,27.93 v55.4,33.33 | 57.94,21.74
PG3
  Top 0.406: IC1.18 45.08,24.42 45.08,19.04 41.27,15.23 41.27,9.52 42.86,7.93 54.76,7.93 55.4,7.3 DISPLAY.13
PG4
  Top 0.406: IC1.19 45.92,18.77 42.06,14.92 42.06,9.84 43.17,8.73 55.08,8.73 56.67,7.14 56.67,5.55 57.3,4.92 66.83,4.92 DISPLAY.3
RX0  (via drill 0.5)
  Top 0.61: IC3.8 20.31,47.14 v20.31,47.94
  Bottom 0.406: 24.6,52.86
  Bottom 0.61: J1.2 27.14,55.4 26.19,54.45 24.6,52.86 19.2,52.86 17.3,50.95 17.3,48.41 17.77,47.94 v20.31,47.94
RX1
  Top 0.61: IC3.13 15.23,55.4 14.6,56.03 J2.2
TX0  (via drill 0.5)
  Top 0.61: IC3.7 19.04,47.3 18.41,47.94 18.41,48.09 v18.41,49.05
  Bottom 0.61: J1.3 29.68,56.03 28.73,55.08 25.39,51.75 19.68,51.75 18.41,50.48 v18.41,49.05
TX1  (via drill 0.5)
  Top 0.406: v13.96,54.13
  Top 0.61: IC3.14 v13.96,54.13
  Bottom 0.61: J2.3 17.14,55.24 16.03,54.13 v13.96,54.13

### Text on the board
Top: TOP
Bottom: H9-Laboratory Ltd. | www.h9l.net | Serial: | BTM
tNames: CH1 | CH0 | +5V | RX | TX | GND | GND | +5V | AVR-Basisboard | H9-Laboratory Ltd. | www.h9l.net | Rev.1.1 2010/19 | A | K